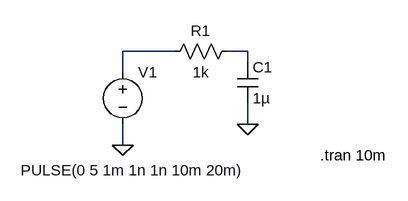
[diagram p0: schematic RC_circuit.asc]
RC_circuit.asc, the LTspice schematic file:
Version 4
SHEET 1 880 680
WIRE 160 128 80 128
WIRE 272 128 240 128
WIRE 272 144 272 128
WIRE 80 160 80 128
WIRE 272 240 272 208
WIRE 80 272 80 240
FLAG 80 272 0
FLAG 272 240 0
SYMBOL res 256 112 R90
WINDOW 0 0 56 VBottom 2
WINDOW 3 32 56 VTop 2
SYMATTR InstName R1
SYMATTR Value 1k
SYMBOL cap 256 144 R0
SYMATTR InstName C1
SYMATTR Value 1µ
SYMBOL voltage 80 144 R0
WINDOW 3 -157 167 Left 2
WINDOW 123 0 0 Left 0
WINDOW 39 0 0 Left 0
SYMATTR InstName V1
SYMATTR Value PULSE(0 5 1m 1n 1n 10m 20m)
TEXT 384 288 Left 2 !.tran 10m

The netlist it stands for:
* RC_circuit.asc
R1 N002 N001 1k
C1 N002 0 1µ
V1 N001 0 PULSE(0 5 1m 1n 1n 10m 20m)
.tran 10m
.backanno
.end